# EAGLE design LCmeter0-LCD-8pinlcd-PIC18F2550-COMP (EAGLE 7.6.0)
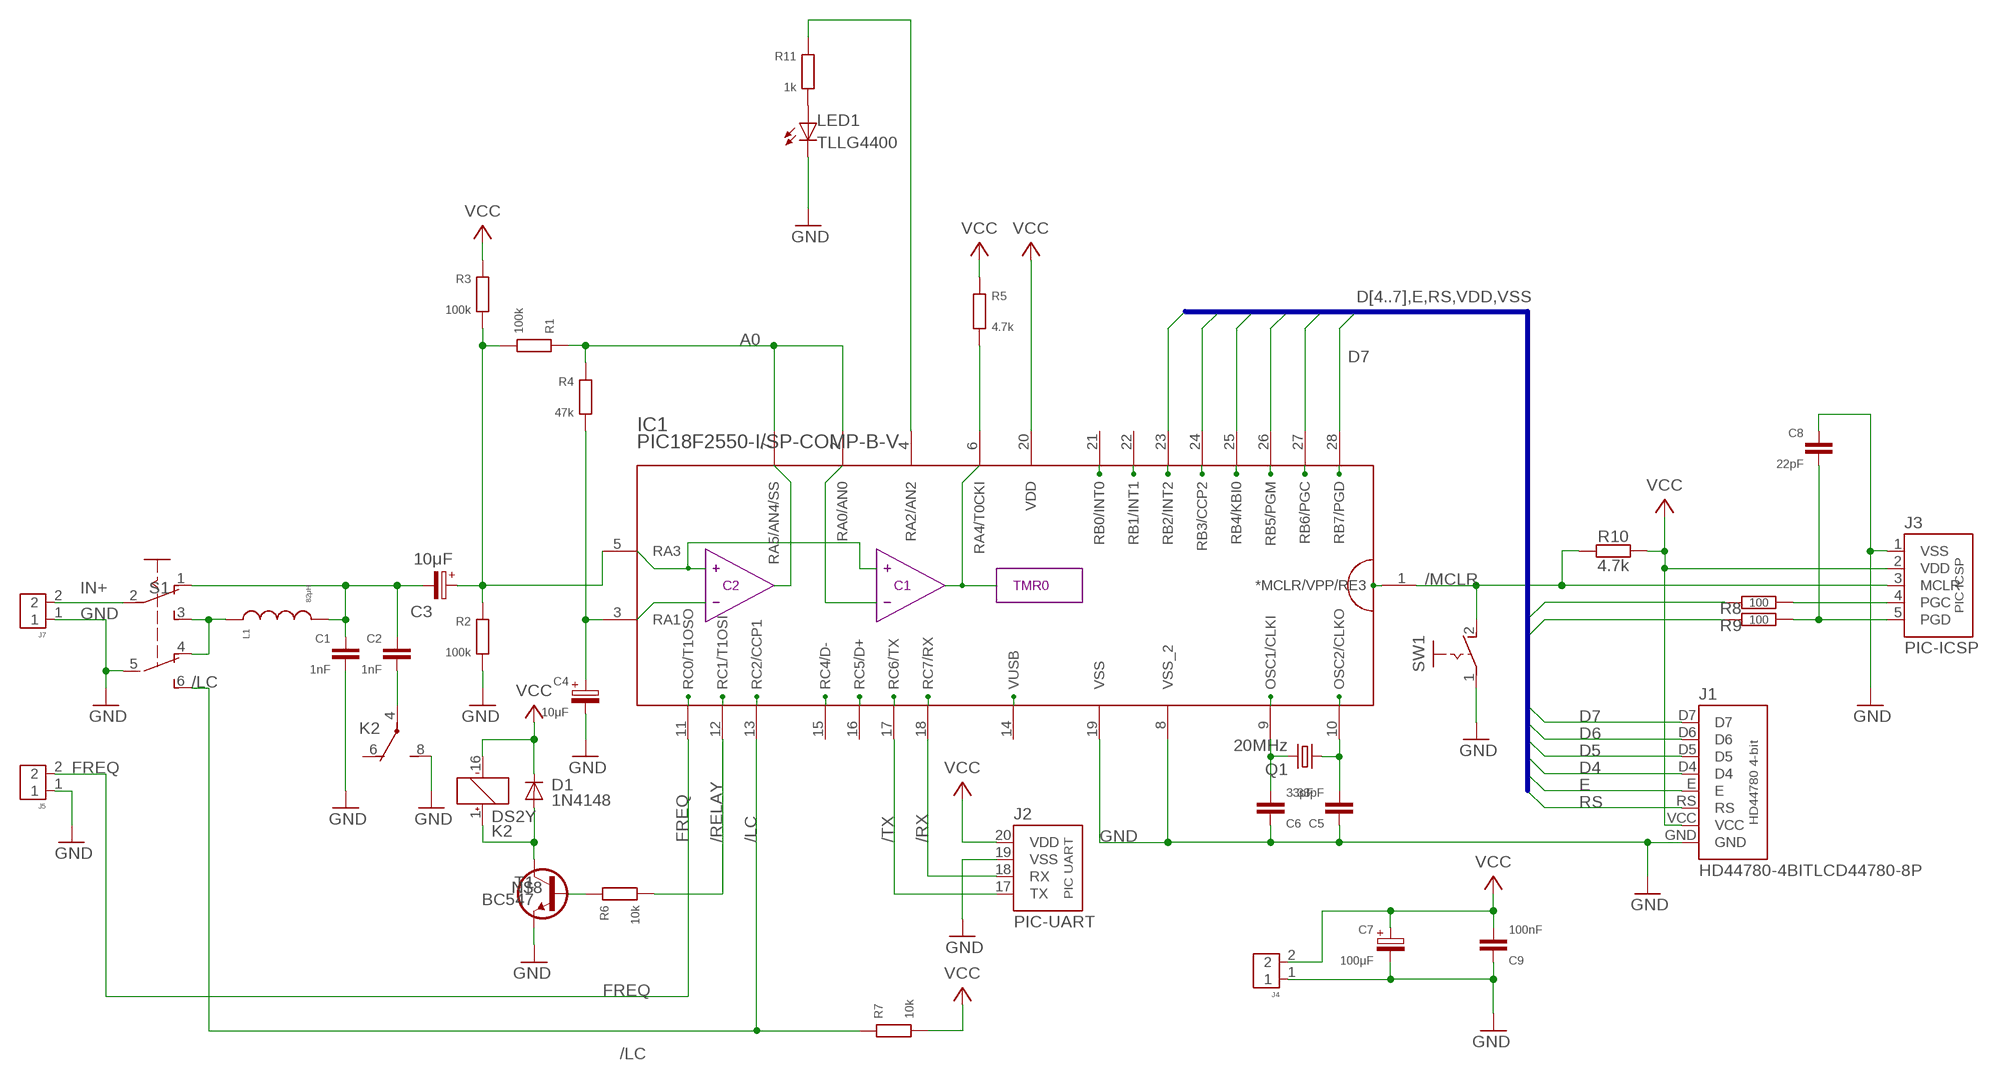
[diagram p0: schematic, sheet 1]

## Parts
C1  1nF  C025-025X060  [C050-025X060]
C2  1nF  C025-025X060  [C050-025X060]
C3  10μF  CPOLE2,5-4  [E2,5-4]
C4  10μF  CPOLE2,5-4  [E2,5-4]
C5  33pF  C025-020X036  [C025-020X036]
C6  33pF  C025-020X036  [C025-020X036]
C7  100μF  CPOLE2.5-5  [E2,5-5]
C8  22pF  C050-020X036  [C050-020X036]
C9  100nF  C025-020X036/V  [C025-020X036/V]
D1  1N4148  1N414834-7  [DO34-7]
IC1  PIC18F2550-I/SP-COMP-B-V  [DIL28-3/V]
J1  HD44780-4BITLCD44780-8P  [CONN-LCD44780]
J2  PIC-UART  [PIC-UART]
J3  PIC-ICSP  PIC-ICSPICSP  [PIC-ICSP]
J4  J4  CONN-2P2P/H  [CONN-2P]
J5  CONN-2P2P/V  [CONN-2P-V]
J7  CONN-2P2P/V  [CONN-2P-V]
K2  DS2Y  DS2Y-S-DC5V  [DS2Y]
L1  82μH  LAXIAL  [0207/10]
LED1  TLLG4400  [LED3MM]
Q1  20MHz  CRYSTALHC49  [HC49]
R1  100k  R0202/7  [0202/7]
R2  100k  R0202/7  [0202/7]
R3  100k  R0202/7  [0202/7]
R4  47k  R0202/7  [0202/7]
R5  4.7k  R0202/7  [0202/7]
R6  10k  R0202/7-V  [0202/7-V]
R7  10k  R0202/10-V  [0202/10-V]
R8  100  R0202/7-V  [0202/7-V]
R9  100  R0202/5-V  [0202/5-V]
R10  4.7k  R0202/7  [0202/7]
R11  1k  R0202/5-V  [0202/5-V]
S1  SL-SW-2P-2T  [SLSW-2P2T]
SW1  PB-1P-1T  [PB-1P1T]
T1  BC547  BC547CBE-A  [TO92-CBE-A]

## Nets
/LC: IC1.13(RC2/CCP1) R7.2 S1.6(S1)
/MCLR: IC1.1(*MCLR/VPP/RE3) J3.3(MCLR) R10.2 SW1.2(S)
/RELAY: IC1.12(RC1/T1OSI) R6.1
/RX: IC1.18(RC7/RX) J2.18(RX)
/TX: IC1.17(RC6/TX) J2.17(TX)
A0: IC1.2(RA0/AN0) IC1.7(RA5/AN4/SS) R1.2 R4.2
A1: C4.+ IC1.3(RA1) R4.1
A3: C3.+ IC1.5(RA3) R1.1 R2.2 R3.1
A4: IC1.6(RA4/T0CKI) R5.1
C2_CON: C2.2 K2.4(2:P)
D4: IC1.25(RB4/KBI0) J1.D4
D5: IC1.26(RB5/PGM) J1.D5
D6: IC1.27(RB6/PGC) J1.D6 R8.2
D7: IC1.28(RB7/PGD) J1.D7 R9.2
E: IC1.24(RB3/CCP2) J1.E
FREQ: IC1.11(RC0/T1OSO) J5.2
GND: C1.2 C4.- C5.1 C6.1 C7.- C8.1 C9.1 IC1.8(VSS_2) IC1.19(VSS) J1.GND J2.19(VSS) J3.1(VSS) J4.1 J5.1 J7.1 K2.8(2:S) LED1.K(C) R2.1 S1.5(P1) SW1.1(P) T1.E
IN+: J7.2 S1.2(P)
N$1: LED1.A R11.1
N$2: C1.1 C2.1 C3.- L1.2 S1.1(O)
N$3: IC1.4(RA2/AN2) R11.2
N$6: R6.2 T1.B
N$7: L1.1 S1.3(S) S1.4(O1)
N$8: D1.A K2.1(1:+) T1.C
OSC1: C6.2 IC1.9(OSC1/CLKI) Q1.2
OSC2: C5.2 IC1.10(OSC2/CLKO) Q1.1
PGC: J3.4(PGC) R8.1
PGD: C8.2 J3.5(PGD) R9.1
RS: IC1.23(RB2/INT2) J1.RS
VCC: C7.+ C9.2 D1.C IC1.20(VDD) J1.VCC J2.20(VDD) J3.2(VDD) J4.2 K2.16(1:-) R3.2 R5.2 R7.1 R10.1
Unconnected: IC1.14(VUSB) IC1.15(RC4/D-) IC1.16(RC5/D+) IC1.21(RB0/INT0) IC1.22(RB1/INT1) K2.6(2:O) K2.9(3:S) K2.11(3:O) K2.13(3:P)

## Buses
D[4..7],E,RS,VDD,VSS

## Library data of the parts
C1 C2 C5 C6 C8 C9 = c:C: CAPACITOR, European symbol
C3 C4 C7 = c:CPOL: POLARIZED CAPACITOR, European symbol
D1 = d:1N4148
IC1 = mcu:PIC18F2550-I/SP-COMP-B
J1 = pinconn:HD44780-4BIT
J2 = pinconn:PIC-UART
J3 = pinconn:PIC-ICSP
J4 J5 J7 = pinconn:CONN-2P
K2 = relay:DS2Y-S-DC*: MINIATURE RELAY NAiS Source: http://www.mew-europe.com/.. en_ds_61005_0023.pdf; MPN: DS2Y-S-DC5V; OC_FARNELL: unknown; OC_NEWARK: 13P3268
L1 = r:L
LED1 = led:TLLG4400: Low Current (2mA) LED 3 mm Tinted Diffused Package color GREEN Source: Data sheet <http://www.farnell.com/datasheets/391098.pdf>; MF: VISHAY SEMICONDUCTOR; OC_FARNELL: 1612435
Q1 = q:CRYSTAL
R1-R11 = r:R: RESISTOR, European symbol
S1 = sw:SL-SW-2P-2T
SW1 = sw:PB-1P-1T
T1 = t:BC547

## Net classes
0 default: width 0.61 mm

## Board
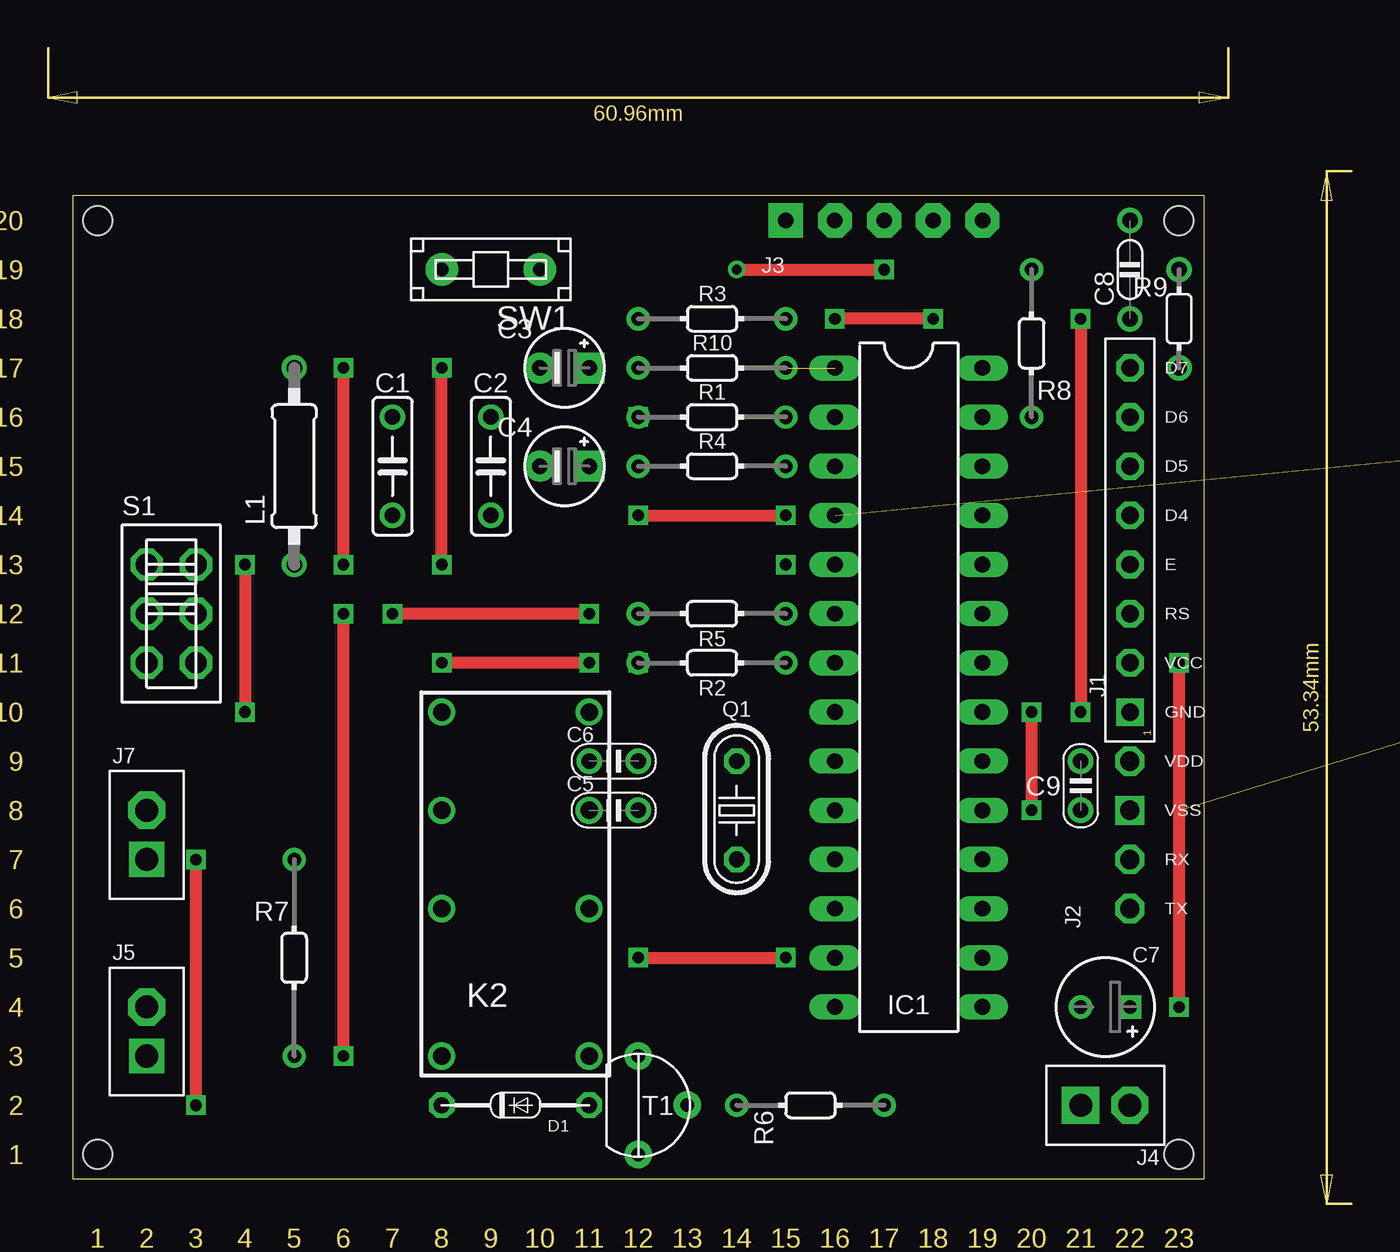
[diagram p1: board, top side]
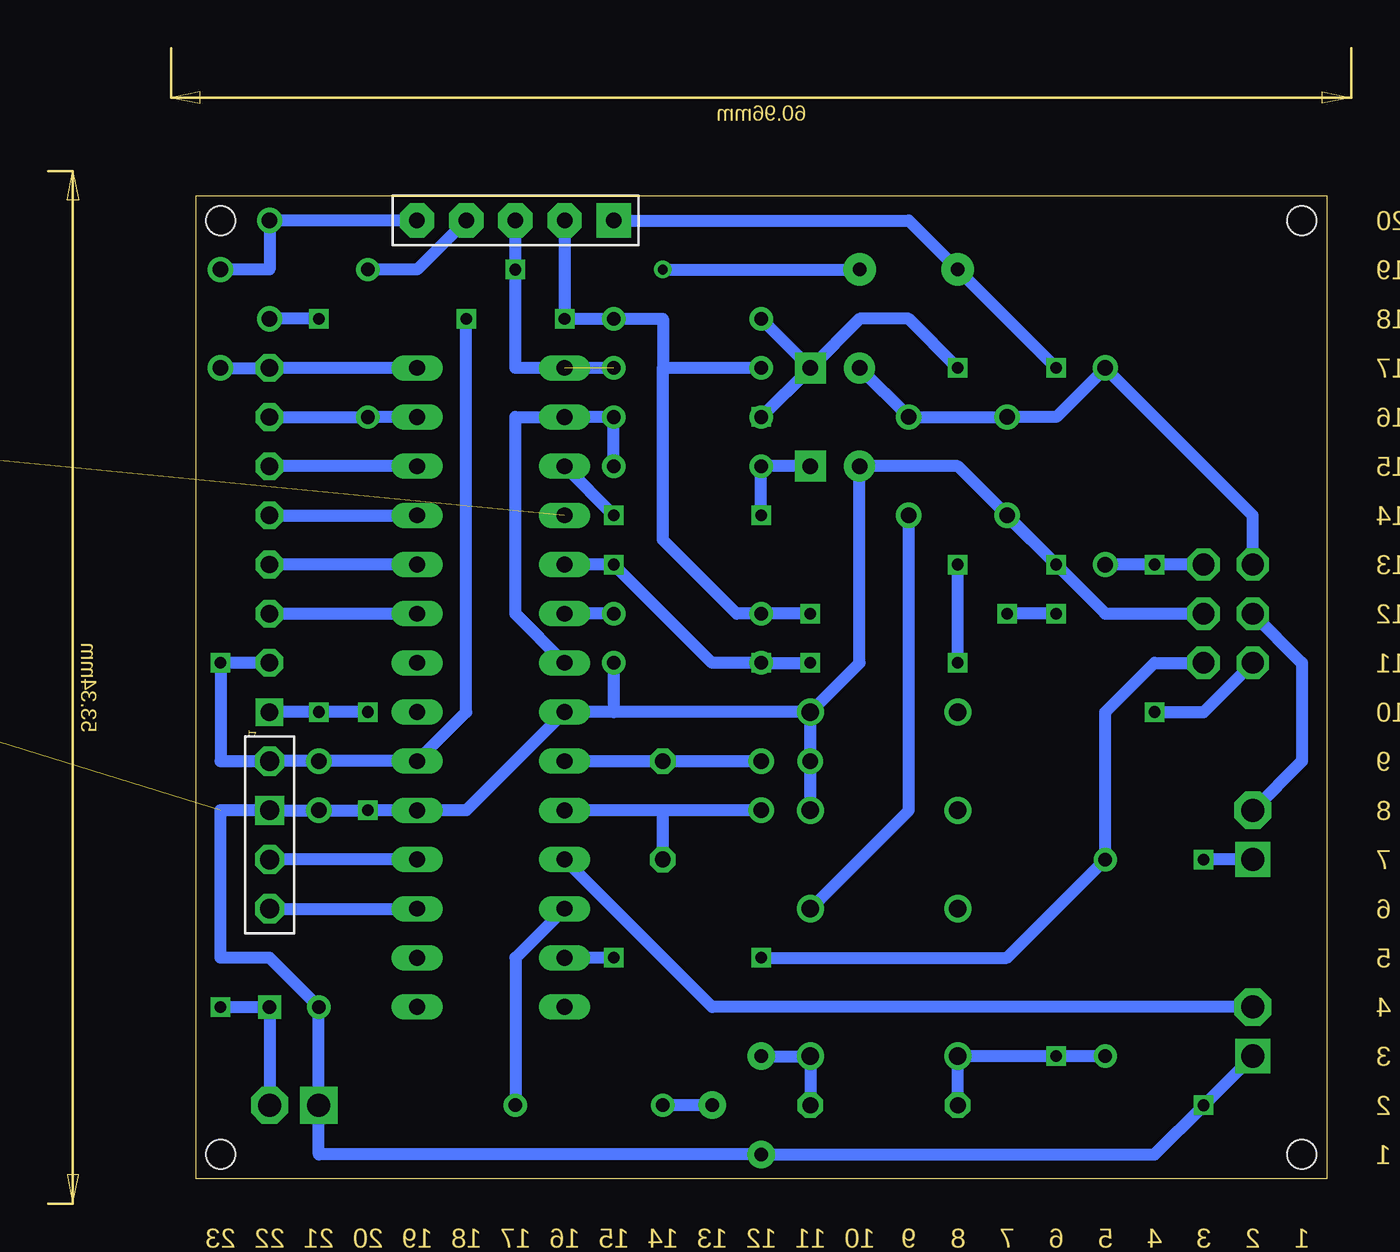
[diagram p2: board, bottom side, seen from below]

Size 58.42 x 50.8 mm. Coordinates in mm from the lower left corner, seen from the top.
Outline: 0,0 58.42,0 58.42,50.8 0,50.8 0,0
Copper layers (1*16): Top 0.035mm / dielectric 1.5mm / Bottom 0.035mm
Design rules "default *": minimum track width 10mil, minimum drill 24mil, track to track 0mil, track to pad 0mil, pad to pad 0mil, via to via 0mil, smd to smd 8mil, copper to edge 40mil, drill to drill 8mil, minimum pad ring 10mil, minimum via ring 8mil, stop-mask expansion 4mil, vias tented up to drill 0mil, thermal gap 10mil
Holes 1.5 mm at 1.27,49.53 57.15,49.53 57.15,1.27 1.27,1.27

### Footprints (pad centres in the part's own frame; a part is rotated, then mirrored left to right if it is on the bottom)
C050-025X060 = drill 0.8: 1 0,2.54; 2 0,-2.54
E2,5-4 = drill 0.8 pad 1.6 square: + 1.27,0 | drill 0.8 pad 1.6: - -1.27,0
C025-020X036 = drill 0.8: 1 0,0; 2 2.54,0
E2,5-5 = drill 0.7 square: + 1.27,0 | drill 0.7: - -1.27,0
C050-020X036 = drill 0.8: 1 0,-2.54; 2 0,2.54
C025-020X036/V = drill 0.8: 1 0,-1.27; 2 0,1.27
DO34-7 = drill 0.813 octagon: A 3.81,0; C -3.81,0
DIL28-3/V = drill 0.813 long: 1 -3.81,16.51; 2 -3.81,13.97; 3 -3.81,11.43; 4 -3.81,8.89; 5 -3.81,6.35; 6 -3.81,3.81; 7 -3.81,1.27; 8 -3.81,-1.27; 9 -3.81,-3.81; 10 -3.81,-6.35; 11 -3.81,-8.89; 12 -3.81,-11.43; 13 -3.81,-13.97; 14 -3.81,-16.51; 15 3.81,-16.51; 16 3.81,-13.97; 17 3.81,-11.43; 18 3.81,-8.89; 19 3.81,-6.35; 20 3.81,-3.81; 21 3.81,-1.27; 22 3.81,1.27; 23 3.81,3.81; 24 3.81,6.35; 25 3.81,8.89; 26 3.81,11.43; 27 3.81,13.97; 28 3.81,16.51
CONN-LCD44780 = drill 0.9 pad 1.422 octagon: D4 0,10.16; D5 0,12.7; D6 0,15.24; D7 0,17.78; E 0,7.62; RS 0,5.08; VCC 0,2.54 | drill 0.9 pad 1.422 square: GND 0,0
PIC-UART = drill 1 octagon: 17 0,0; 18 0,2.54; 20 0,7.62 | drill 1 square: 19 0,5.08
PIC-ICSP = drill 0.8 pad 1.778 square: 1 0,0 | drill 0.8 pad 1.778 octagon: 2 2.54,0; 3 5.08,0; 4 7.62,0; 5 10.16,0
CONN-2P = drill 1.2 pad 1.93 square: 1 0,0 | drill 1.2 pad 1.93 octagon: 2 -2.54,0
CONN-2P-V = drill 1.2 pad 1.778 square: 1 0,0 | drill 1.2 pad 1.93 octagon: 2 0,2.54
DS2Y = drill 0.9: 1 -8.89,-3.81; 4 -1.27,-3.81; 6 3.81,-3.81; 8 8.89,-3.81; 9 8.89,3.81; 11 3.81,3.81; 13 -1.27,3.81; 16 -8.89,3.81
0207/10 = drill 0.8: 1 -5.08,0; 2 5.08,0
LED3MM = drill 0.813 octagon: A -1.27,0; K 1.27,0
HC49 = drill 0.813 octagon: 1 0,-2.54; 2 0,2.54
0202/7 = drill 0.7: 1 -3.81,0; 2 3.81,0
0202/7-V = drill 0.7: 1 0,-3.81; 2 0,3.81
0202/10-V = drill 0.7: 1 0,-5.08; 2 0,5.08
0202/5-V = drill 0.8: 1 0,2.54; 2 0,-2.54
SLSW-2P2T = drill 1.118 pad 1.524 octagon: 1 -1.27,2.54; 2 -1.27,0; 3 -1.27,-2.54; 4 1.27,2.54; 5 1.27,0; 6 1.27,-2.54
PB-1P1T = drill 0.7 pad 1.676: 1 2.54,0; 2 -2.54,0
TO92-CBE-A = drill 0.7 pad 1.422: B 2.54,0; C 0,2.54; E 0,-2.54

### Placement (x,y rotation side)
C1  16.51,36.83 0 top
C2  21.59,36.83 0 top
C3  25.4,41.91 0 top
C4  25.4,36.83 0 top
C5  26.67,19.05 0 top
C6  26.67,21.59 0 top
C7  53.34,8.89 0 top
C8  54.61,46.99 0 top
C9  52.07,20.32 0 top
D1  22.86,3.81 0 top
IC1  43.18,25.4 0 top
J1  54.61,24.13 0 top
J2  54.61,13.97 0 top
J3  36.83,49.53 0 top
J4  52.07,3.81 180 top
J5  3.81,6.35 0 top
J7  3.81,16.51 0 top
K2  22.86,15.24 90 top
L1  11.43,36.83 90 top
LED1  73.66,25.4 270 top  (outside the outline)
Q1  34.29,19.05 0 top
R1  33.02,39.37 0 top
R2  33.02,26.67 180 top
R3  33.02,44.45 0 top
R4  33.02,36.83 0 top
R5  33.02,29.21 180 top
R6  38.1,3.81 90 top
R7  11.43,11.43 0 top
R8  49.53,43.18 180 top
R9  57.15,44.45 0 top
R10  33.02,41.91 0 top
R11  78.74,35.56 180 top  (outside the outline)
S1  5.08,29.21 0 top
SW1  21.59,46.99 180 top
T1  29.21,3.81 0 top

### Tracks (layer width: path | path; a pad name or v marks a point on that pad's centre or on a via)
/LC  (via drill 0.6)
  Top 0.61: v29.21,11.43 v36.83,11.43
  Bottom 0.61: v29.21,11.43 16.51,11.43 R7.2 11.43,24.13 8.89,26.67 S1.6 | v36.83,11.43 IC1.13
/MCLR  (via drill 0.5, 0.6)  (1 unrouted)
  Top 0.61: v34.29,46.99 v41.91,46.99
  Bottom 0.61: J3.3 v41.91,46.99 41.91,41.91 R10.2 | v34.29,46.99 SW1.2
/RELAY
  Bottom 0.61: IC1.12 41.91,11.43 R6.1
/RX
  Bottom 0.61: IC1.18 J2.18
/TX
  Bottom 0.61: J2.17 IC1.17
A0
  Bottom 0.61: R4.2 R1.2 IC1.2 41.91,39.37 41.91,29.21 IC1.7
A1  (via drill 0.6)
  Top 0.61: v29.21,34.29 v36.83,34.29
  Bottom 0.61: v29.21,34.29 R4.1 C4.+ | IC1.3 v36.83,34.29
A3  (via drill 0.6)
  Top 0.61: v26.67,26.67 v19.05,26.67 | v19.05,31.75 v19.05,41.91
  Bottom 0.61: R3.1 C3.+ | R1.1 C3.+ | IC1.5 v36.83,31.75 31.75,26.67 R2.2 v26.67,26.67 | v19.05,26.67 v19.05,31.75 | v19.05,41.91 21.59,44.45 24.13,44.45 C3.+
  other vias: 29.21,39.37 29.21,26.67
A4
  Bottom 0.61: R5.1 IC1.6
C2_CON
  Bottom 0.61: K2.4 21.59,19.05 C2.2
D4
  Bottom 0.61: J1.D4 IC1.25
D5
  Bottom 0.61: IC1.26 J1.D5
D6
  Bottom 0.61: J1.D6 R8.2 IC1.27
D7
  Bottom 0.61: R9.2 J1.D7 IC1.28
E
  Bottom 0.61: IC1.24 J1.E
FREQ
  Bottom 0.61: J5.2 31.75,8.89 IC1.11
GND  (via drill 0.6)  (1 unrouted)
  Top 0.61: v49.53,24.13 v49.53,19.05 | v13.97,41.91 v13.97,31.75 | v52.07,44.45 v52.07,24.13 | v6.35,16.51 v6.35,3.81
  Bottom 0.61: C5.1 C6.1 K2.8 | K2.8 36.83,24.13 | v49.53,24.13 v52.07,24.13 J1.GND | v13.97,31.75 19.05,36.83 C4.- 24.13,26.67 K2.8 | C1.2 v13.97,31.75 | v13.97,41.91 SW1.1 21.59,49.53 J3.1 | v52.07,44.45 C8.1 | J7.1 v6.35,16.51 | J5.1 v6.35,3.81 8.89,1.27 T1.E 52.07,1.27 J4.1 C7.- 54.61,11.43 57.15,11.43 57.15,19.05 J2.19 C9.1 v49.53,19.05 IC1.19 44.45,19.05 IC1.8 36.83,24.13 | v13.97,31.75 11.43,29.21 S1.5 | R2.1 36.83,24.13
IN+
  Bottom 0.61: S1.2 1.27,26.67 1.27,21.59 J7.2
N$1  (1 unrouted)
N$2
  Bottom 0.61: C3.- C2.1 C1.1 13.97,39.37 L1.2 3.81,34.29 S1.1
N$3  (1 unrouted)
N$6
  Bottom 0.61: T1.B R6.2
N$7  (via drill 0.6)
  Top 0.61: v8.89,31.75 v8.89,24.13
  Bottom 0.61: v8.89,24.13 6.35,24.13 S1.3 | S1.4 v8.89,31.75 L1.1
N$8
  Bottom 0.61: T1.C K2.1 D1.A
OSC1
  Bottom 0.61: C6.2 Q1.2 IC1.9
OSC2
  Bottom 0.61: C5.2 34.29,19.05 | Q1.1 34.29,19.05 | 34.29,19.05 IC1.10
PGC
  Bottom 0.61: J3.4 46.99,46.99 R8.1
PGD
  Bottom 0.61: J3.5 C8.2 54.61,46.99 R9.1
RS
  Bottom 0.61: J1.RS IC1.23
VCC  (via drill 0.6)
  Top 0.61: v13.97,29.21 v13.97,6.35 | v16.51,29.21 v26.67,29.21 | v44.45,44.45 v39.37,44.45 | v57.15,26.67 v57.15,8.89
  Bottom 0.61: R7.1 v13.97,6.35 K2.16 D1.C | v26.67,29.21 R5.2 30.48,29.21 34.29,33.02 34.29,41.91 | 34.29,41.91 34.29,44.45 R3.2 v39.37,44.45 J3.2 | v13.97,29.21 v16.51,29.21 | v44.45,44.45 44.45,24.13 IC1.20 C9.2 J2.20 57.15,21.59 v57.15,26.67 J1.VCC | R10.1 34.29,41.91 | J4.2 C7.+ v57.15,8.89

### Text on the board
Dimension: 20 | 19 | 18 | 17 | 16 | 15 | 14 | 13 | 12 | 11 | 10 | 9 | 8 | 7 | 6 | 5 | 4 | 3 | 2 | 1 | 1 | 2 | 3 | 4 | 5 | 6 | 7 | 8 | 9 | 10 | 11 | 12 | 13 | 14 | 15 | 16 | 17 | 18 | 19 | 20 | 21 | 22 | 23